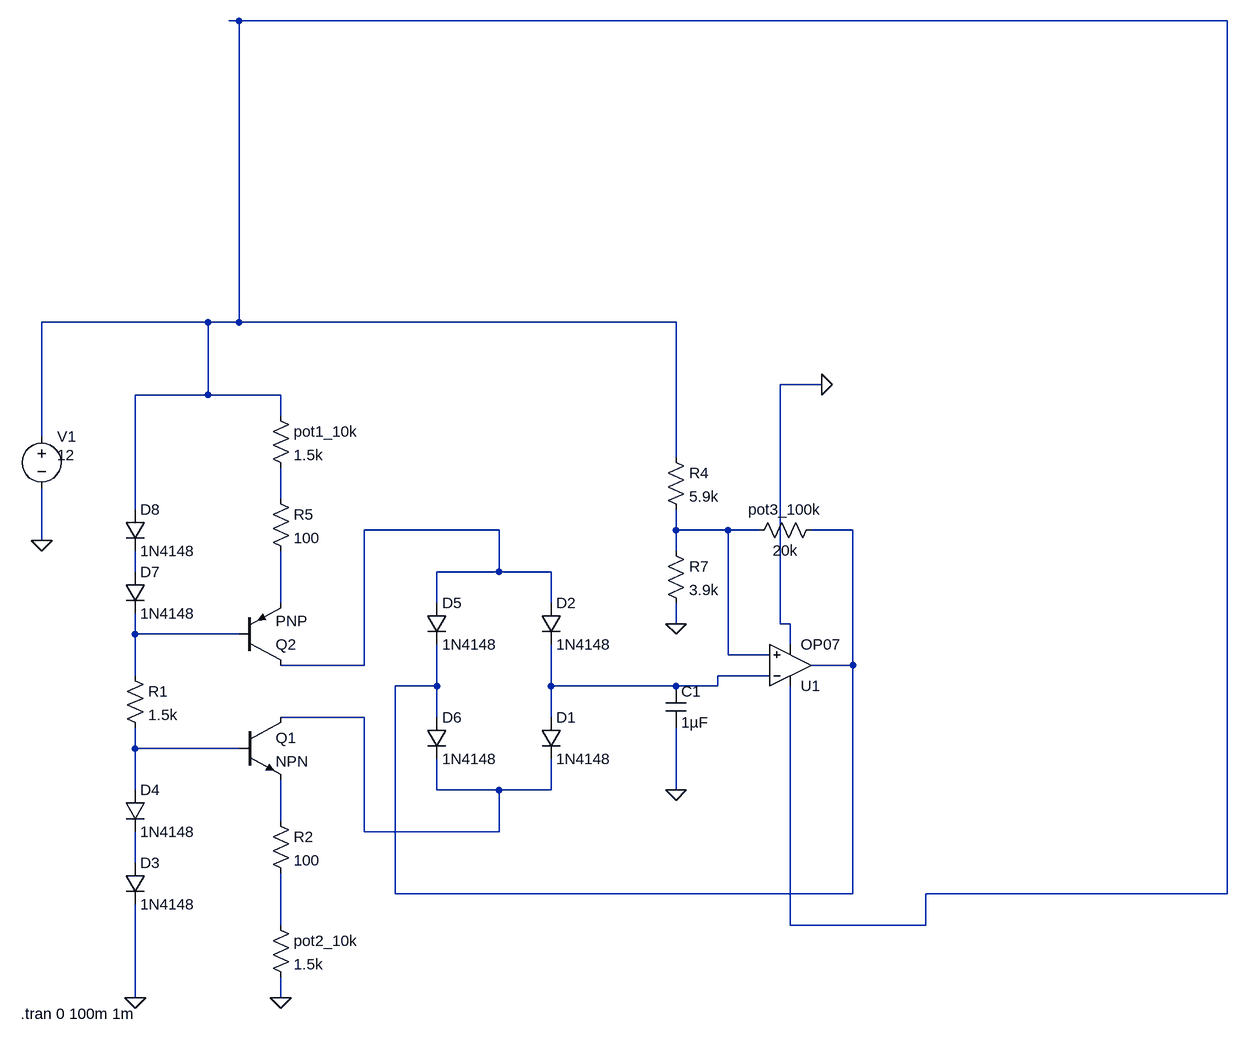
[diagram p0: schematic IE_Final_Project.asc]
IE_Final_Project.asc, the LTspice schematic file:
Version 4
SHEET 1 1780 792
WIRE 256 -752 240 -752
WIRE 1776 -752 256 -752
WIRE 208 -288 -48 -288
WIRE 256 -288 256 -752
WIRE 256 -288 208 -288
WIRE 928 -288 256 -288
WIRE 1152 -192 1088 -192
WIRE 208 -176 208 -288
WIRE 208 -176 96 -176
WIRE 320 -176 208 -176
WIRE 320 -144 320 -176
WIRE -48 -112 -48 -288
WIRE 928 -80 928 -288
WIRE 320 -16 320 -64
WIRE 96 0 96 -176
WIRE 656 32 448 32
WIRE 928 32 928 0
WIRE 1008 32 928 32
WIRE 1056 32 1008 32
WIRE 1200 32 1136 32
WIRE -48 48 -48 -32
WIRE 928 64 928 32
WIRE 96 96 96 64
WIRE 656 96 656 32
WIRE 656 96 560 96
WIRE 736 96 656 96
WIRE 320 144 320 64
WIRE 560 144 560 96
WIRE 736 144 736 96
WIRE 928 176 928 144
WIRE 1088 176 1088 -192
WIRE 1104 176 1088 176
WIRE 96 192 96 160
WIRE 256 192 96 192
WIRE 1104 208 1104 176
WIRE 1008 224 1008 32
WIRE 1072 224 1008 224
WIRE 448 240 448 32
WIRE 448 240 320 240
WIRE 1200 240 1200 32
WIRE 1200 240 1136 240
WIRE 96 256 96 192
WIRE 1072 256 992 256
WIRE 560 272 560 208
WIRE 560 272 496 272
WIRE 736 272 736 208
WIRE 928 272 736 272
WIRE 992 272 992 256
WIRE 992 272 928 272
WIRE 448 320 320 320
WIRE 560 320 560 272
WIRE 736 320 736 272
WIRE 96 368 96 336
WIRE 256 368 96 368
WIRE 96 432 96 368
WIRE 560 432 560 384
WIRE 656 432 560 432
WIRE 736 432 736 384
WIRE 736 432 656 432
WIRE 928 432 928 336
WIRE 320 480 320 416
WIRE 448 496 448 320
WIRE 656 496 656 432
WIRE 656 496 448 496
WIRE 96 544 96 496
WIRE 496 592 496 272
WIRE 1200 592 1200 240
WIRE 1200 592 496 592
WIRE 1776 592 1776 -752
WIRE 1776 592 1312 592
WIRE 320 640 320 560
WIRE 1104 640 1104 272
WIRE 1312 640 1312 592
WIRE 1312 640 1104 640
WIRE 96 752 96 608
WIRE 320 752 320 720
FLAG 96 752 0
FLAG 320 752 0
FLAG 928 432 0
FLAG 928 176 0
FLAG -48 48 0
FLAG 1152 -192 0
SYMBOL res 80 240 R0
SYMATTR InstName R1
SYMATTR Value 1.5k
SYMBOL npn 256 320 R0
SYMATTR InstName Q1
SYMBOL pnp 256 240 M180
SYMATTR InstName Q2
SYMBOL res 304 464 R0
SYMATTR InstName R2
SYMATTR Value 100
SYMBOL res 304 624 R0
SYMATTR InstName pot2_10k
SYMATTR Value 1.5k
SYMBOL res 304 -32 R0
SYMATTR InstName R5
SYMATTR Value 100
SYMBOL res 304 -160 R0
SYMATTR InstName pot1_10k
SYMATTR Value 1.5k
SYMBOL cap 912 272 R0
SYMATTR InstName C1
SYMATTR Value 1µF
SYMBOL OpAmps\\OP07 1104 304 M180
SYMATTR InstName U1
SYMBOL res 912 -96 R0
SYMATTR InstName R4
SYMATTR Value 5.9k
SYMBOL res 912 48 R0
SYMATTR InstName R7
SYMATTR Value 3.9k
SYMBOL res 1152 16 R90
WINDOW 0 0 56 VBottom 2
WINDOW 3 32 56 VTop 2
SYMATTR InstName pot3_100k
SYMATTR Value 20k
SYMBOL diode 544 144 R0
SYMATTR InstName D5
SYMATTR Value 1N4148
SYMBOL diode 544 320 R0
SYMATTR InstName D6
SYMATTR Value 1N4148
SYMBOL diode 720 320 R0
SYMATTR InstName D1
SYMATTR Value 1N4148
SYMBOL diode 720 144 R0
SYMATTR InstName D2
SYMATTR Value 1N4148
SYMBOL diode 80 544 R0
SYMATTR InstName D3
SYMATTR Value 1N4148
SYMBOL diode 80 432 R0
SYMATTR InstName D4
SYMATTR Value 1N4148
SYMBOL diode 80 96 R0
SYMATTR InstName D7
SYMATTR Value 1N4148
SYMBOL diode 80 0 R0
SYMATTR InstName D8
SYMATTR Value 1N4148
SYMBOL voltage -48 -128 R0
WINDOW 123 0 0 Left 0
WINDOW 39 0 0 Left 0
WINDOW 3 24 44 Left 2
SYMATTR Value 12
SYMATTR InstName V1
TEXT -80 776 Left 2 !.tran 0 100m 1m

The netlist it stands for:
* IE_Final_Project.asc
R1 N008 N011 1.5k
Q1 N010 N011 N012 0 NPN
Q2 N003 N008 N007 0 PNP
R2 N012 N014 100
R§pot2_10k N014 0 1.5k
R5 N002 N007 100
R§pot1_10k N001 N002 1.5k
C1 N009 0 1µF
XU1 N004 N009 N001 0 N005 LT1001  ; OP07, pins In+ In- V+ V- OUT
R4 N001 N004 5.9k
R7 N004 0 3.9k
R§pot3_100k N005 N004 20k
D5 N003 N005 1N4148
D6 N005 N010 1N4148
D1 N009 N010 1N4148
D2 N003 N009 1N4148
D3 N013 0 1N4148
D4 N011 N013 1N4148
D7 N006 N008 1N4148
D8 N001 N006 1N4148
V1 N001 0 12
.model D D
.lib standard.dio
.model NPN NPN
.model PNP PNP
.lib standard.bjt
.tran 0 100m 1m
.lib LTC.lib
.backanno
.end